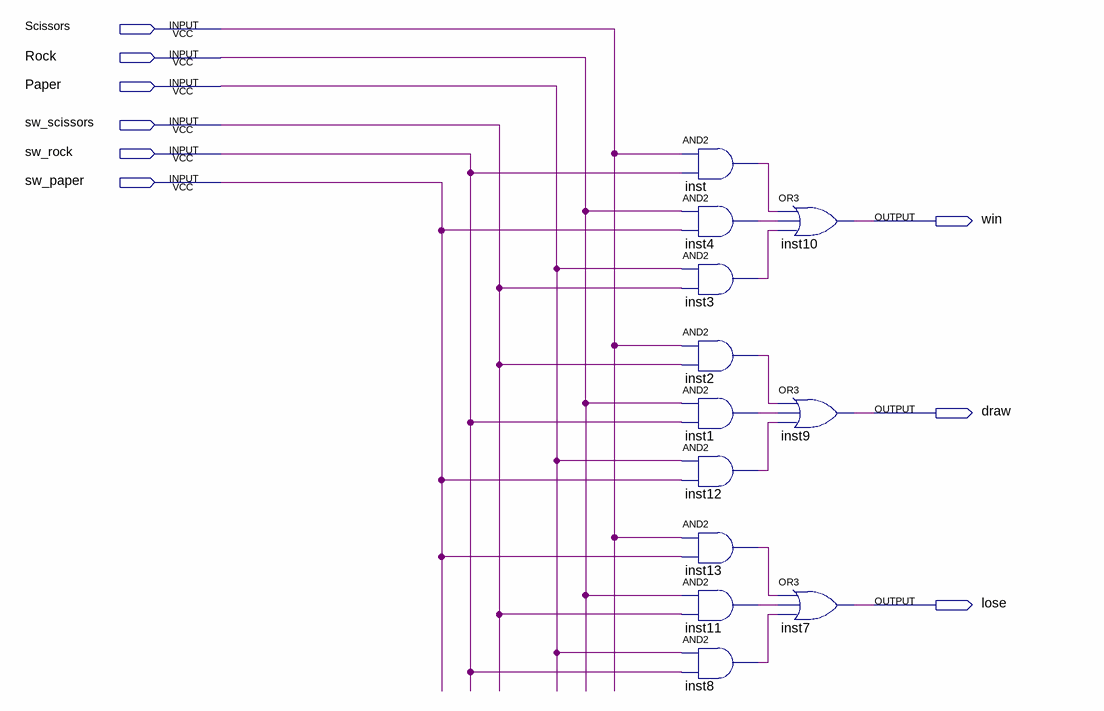
[diagram p0: schematic sheet]
// Quartus schematic win_lose.bdf as structural Verilog: 12 symbols, 9 pins
module win_lose (
  input  Scissors,
  input  Rock,
  input  Paper,
  input  sw_scissors,
  input  sw_rock,
  input  sw_paper,
  output win,
  output draw,
  output lose
);

  wire inst1_out, inst2_out, inst3_out, inst4_out, inst8_out, inst11_out, inst12_out, inst13_out, inst_out;

  and inst (inst_out, Scissors, sw_rock);
  and inst4 (inst4_out, Rock, sw_paper);
  and inst3 (inst3_out, Paper, sw_scissors);
  and inst2 (inst2_out, Scissors, sw_scissors);
  and inst1 (inst1_out, Rock, sw_rock);
  and inst12 (inst12_out, Paper, sw_paper);
  and inst13 (inst13_out, Scissors, sw_paper);
  and inst11 (inst11_out, Rock, sw_scissors);
  and inst8 (inst8_out, Paper, sw_rock);
  or inst10 (win, inst_out, inst4_out, inst3_out);
  or inst9 (draw, inst2_out, inst1_out, inst12_out);
  or inst7 (lose, inst13_out, inst11_out, inst8_out);
endmodule
